# Altium schematic sheet voltage_regulator.SchDoc
size A
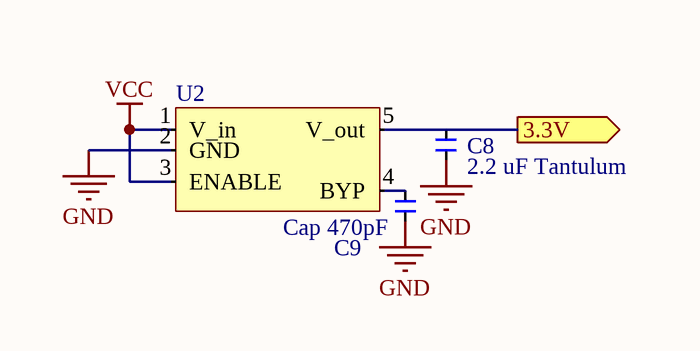
[diagram p0: voltage_regulator.SchDoc]

## Parts
C8  2.2 uF Tantulum
C9  Cap 470pF
U2  MIC5219 3.3 V  (value not drawn)

## Ports
3.3V (out)

## Nets
GND: C8.5 C9.5 U2.2(GND)
VCC: U2.1(V_in) U2.3(ENABLE)
3.3V: C8.4 U2.5(V_out) ; port 3.3V
NetC9_4: C9.4 U2.4(BYP)

## Library data of the parts
C8 = 2.2 uF Tantulum Cap: Manufacturer 1: KEMET; Manufacturer Part Number 1: T491B335M020AT; Dielectric Material: Tantalum; Tolerance: 20%; Capacitance: 3.3uF; Voltage Rating: 20V; ESR (Equivalent Series Resistance): 3R; Polarity: Polar; Life (Hours): 2000Hour; Dissipation Factor: 6%; Supplier 1: Digi-Key; Stock 1: 46393; Pricing 1: 1=0.47000, 10=0.33100, 100=0.21770, 500=0.16124, 1000=0.13705 (USD); RoHS: Yes; Mount: Surface Mount; Case/Package: 1411; Number of Pins: 2; Case Code (Imperial): 1411; Case Code (Metric): 3528; Min Operating Temperature: -55°C; Max Operating Temperature: 125°C; Packaging: Tape and Reel; Package Quantity: 1; Termination: SMD/SMT; Voltage Rating (DC): 20V; Features: General Purpose; Length: 3.5mm; Height: 2.1mm; Width: 2.8mm; Depth: 2.8mm; Height - Seated (Max): 0.083inch; Radiation Hardening: No; Lead Free: Lead Free; ComponentLink1URL: https://datasheet.ciiva.com/6248/kem-t2005-t491-6248059.pdf?src-supplier=Digi-Key; ComponentLink1Description: https://datasheet.ciiva.com/6248/kem-t2005-t491-6248059.pdf?src-supplier=Digi-Key; ComponentLink2URL: https://datasheet.ciiva.com/12884/kem-t2005-t491-12884104.pdf?src-supplier=Mouser; ComponentLink2Description: https://datasheet.ciiva.com/12884/kem-t2005-t491-12884104.pdf?src-supplier=Mouser; ComponentLink3URL: https://datasheet.ciiva.com/6248/kem-t2005-t491-6248060.pdf?src-supplier=Digi-Key; ComponentLink3Description: https://datasheet.ciiva.com/6248/kem-t2005-t491-6248060.pdf?src-supplier=Digi-Key; ComponentLink4URL: https://datasheet.ciiva.com/6248/kem-t2005-t491-6248061.pdf?src-supplier=Digi-Key; ComponentLink4Description: https://datasheet.ciiva.com/6248/kem-t2005-t491-6248061.pdf?src-supplier=Digi-Key; Supplier Part Number 1: 399-10146-1-ND
U2 = MIC5219 3.3 V: Manufacturer 1: Microchip; Manufacturer Part Number 1: MIC5219-3.3YM5-TR; Output Current: 500mA; Dropout Voltage: 350mV; Number of Regulators: 1; Output Voltage: 3.3V; Min Input Voltage: 2.5V; Max Input Voltage: 12V; Output Type: Fixed; Supplier 1: Mouser; Stock 1: 4213; Pricing 1: 1=0.89000, 10=0.89000, 25=0.74000, 100=0.67000, 250=0.67000, 500=0.67000 (USD); RoHS: Yes; Mount: Surface Mount; Case/Package: SOT-23-5; Number of Pins: 5; Min Operating Temperature: -40°C; Max Operating Temperature: 125°C; Packaging: Cut Tape; Nominal Output Voltage: 3.3V; Lead Free: Lead Free; REACH SVHC: No SVHC; ComponentLink1URL: https://datasheet.ciiva.com/15111/getdatasheetpartid-82344-15111461.pdf?src-supplier=Verical; ComponentLink1Description: https://datasheet.ciiva.com/15111/getdatasheetpartid-82344-15111461.pdf?src-supplier=Verical; ComponentLink2URL: https://datasheet.ciiva.com/16208/mic5219-16208920.pdf?src-supplier=Future+Electronics; ComponentLink2Description: https://datasheet.ciiva.com/16208/mic5219-16208920.pdf?src-supplier=Future+Electronics; Supplier Part Number 1: 998-MIC5219-3.3YM5TR